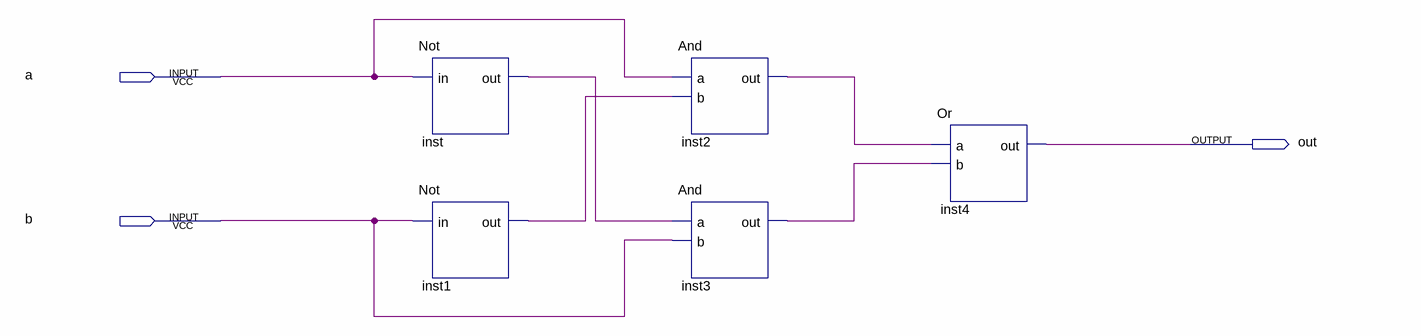
[diagram p0: schematic sheet]
// Quartus schematic Xor.bdf as structural Verilog: 5 symbols, 3 pins
module Xor (
  input  a,
  input  b,
  output out
);

  wire inst1_out, inst2_out, inst3_out, inst_out;

  not inst (inst_out, a);
  not inst1 (inst1_out, b);
  And inst2 (.a(a), .b(inst1_out), .out(inst2_out));
  And inst3 (.a(inst_out), .b(b), .out(inst3_out));
  Or inst4 (.a(inst2_out), .b(inst3_out), .out(out));
endmodule
